# EAGLE schematic Kickerboard (EAGLE 9.6.2)
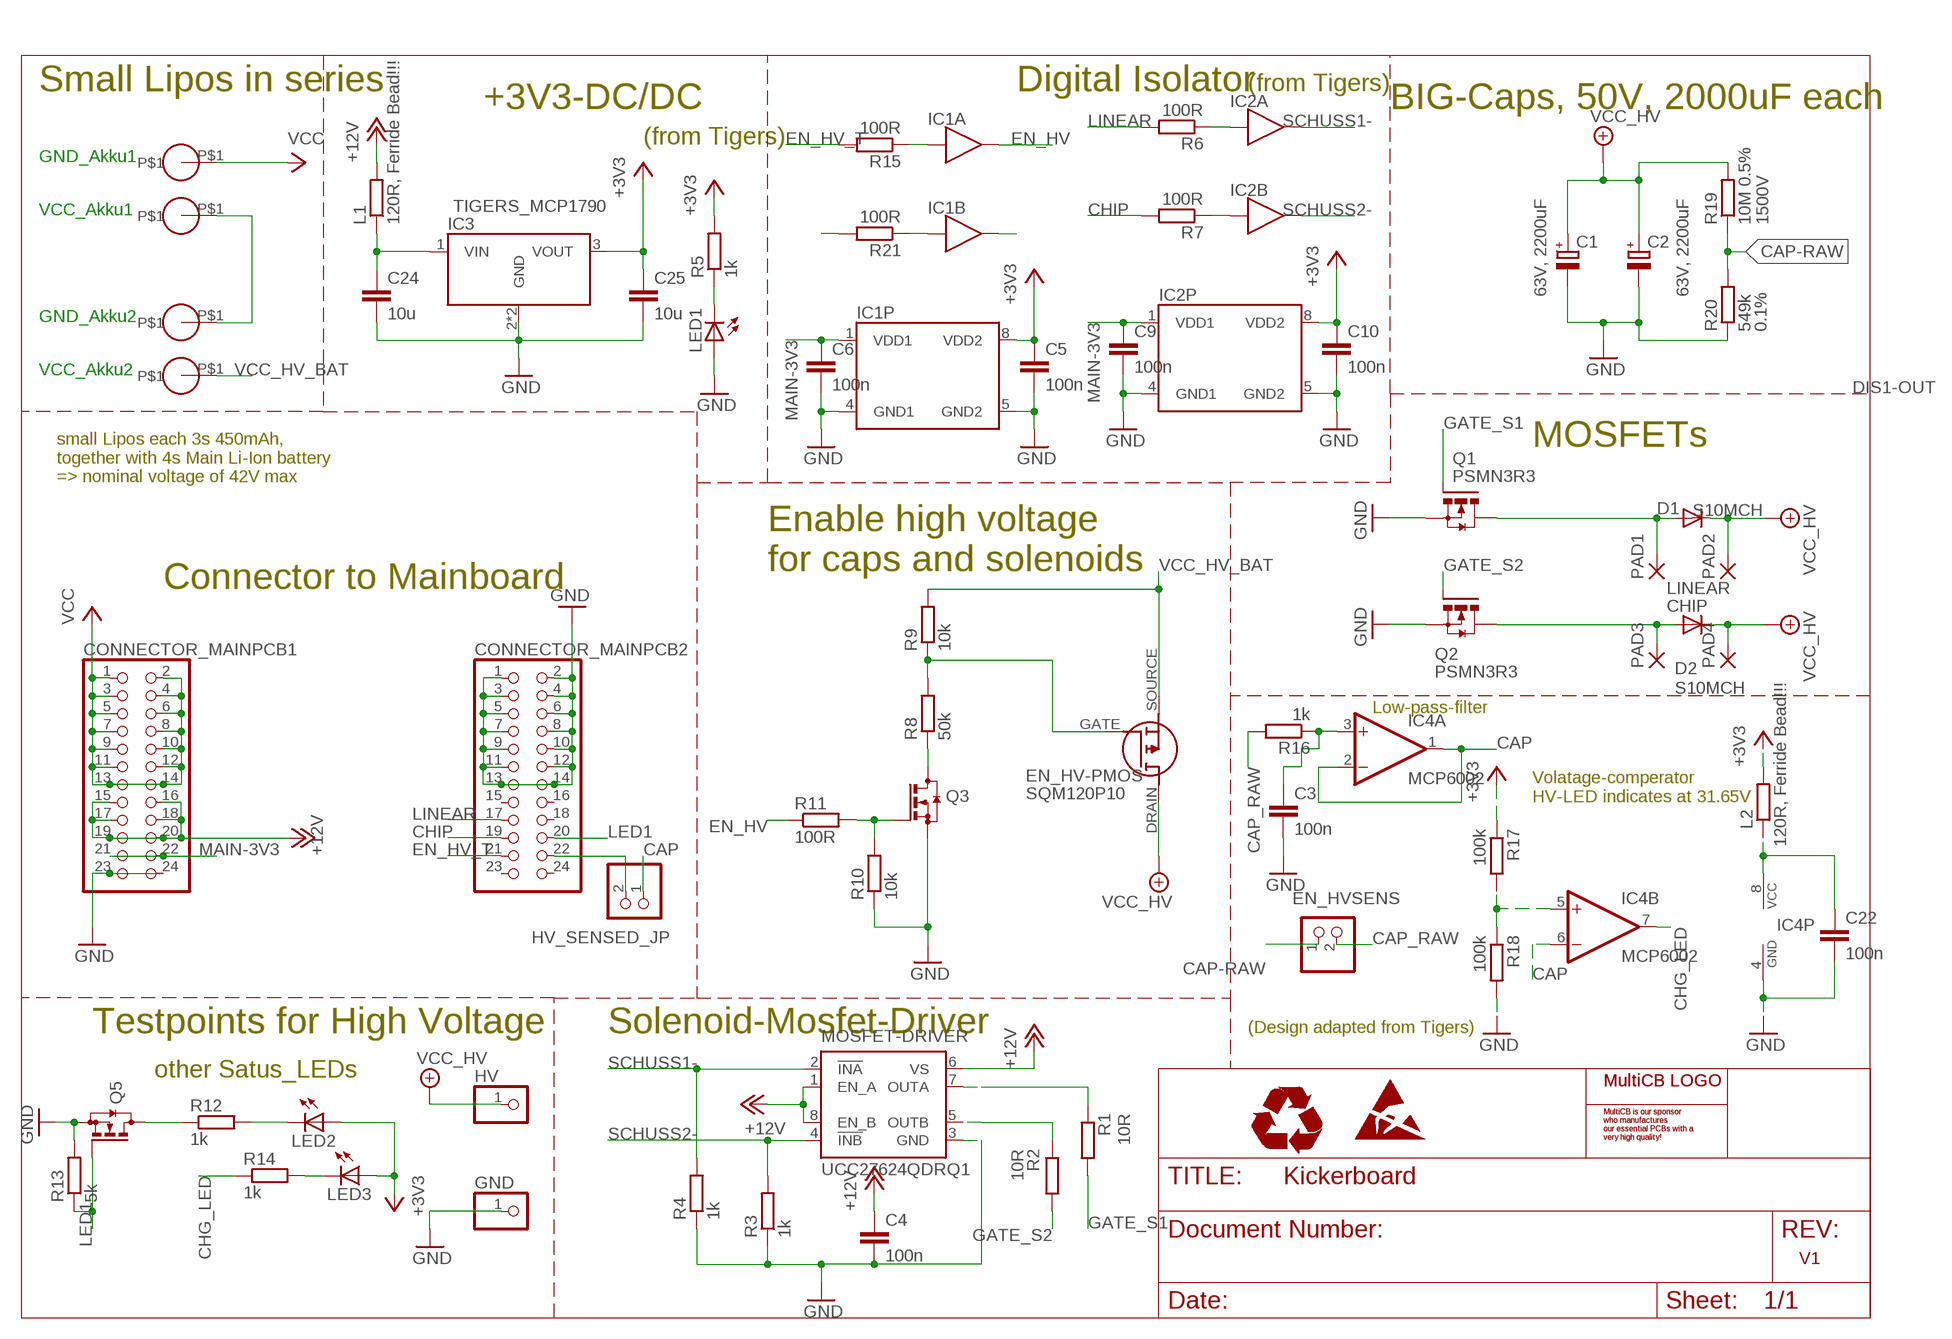
[diagram p0: schematic, sheet 1]

## Parts
C1  63V, 2200uF  OPEN24_SCHUSS_KONDENSATOR(18MM)E7.5-18  [OPEN24_RCL_E7,5-18]
C2  63V, 2200uF  OPEN24_SCHUSS_KONDENSATOR(18MM)E7.5-18  [OPEN24_RCL_E7,5-18]
C3  100n  C-EUC0603  [C0603]
C4  100n  C-EUC0603  [C0603]
C5  100n  C-EUC0603  [C0603]
C6  100n  C-EUC0603  [C0603]
C9  100n  C-EUC0603  [C0603]
C10  100n  C-EUC0603  [C0603]
C22  100n  C-EUC0603  [C0603]
C24  10u  C-EUC0603  [C0603]
C25  10u  C-EUC0603  [C0603]
CONNECTOR_MAINPCB1  PINHD-2X12  [2X12]
CONNECTOR_MAINPCB2  PINHD-2X12  [2X12]
D1  S10MCH  OPEN24_SCHUSS_DIODESMC  [OPEN24_DIODE_SMC:1]
D2  S10MCH  OPEN24_SCHUSS_DIODESMC  [OPEN24_DIODE_SMC:1]
EN_HV-PMOS  SQM120P10  SQM120P10_10M1LGE3_SQM120P10_10M1LGE3  [SQM120P10_10M1LGE3_SQM120P10_10M1LGE3]
EN_HVSENS  PINHD-1X2  [1X02]
GND  PINHD-1X1  [1X01]
GND_A1  MOTOR-DRIVER_PPAD  [MOTOR-DRIVER_PPAD]
GND_A2  MOTOR-DRIVER_PPAD  [MOTOR-DRIVER_PPAD]
HV  PINHD-1X1  [1X01]
HV_SENSED_JP  PINHD-1X2  [1X02]
IC1  TIGERS_SI8620  [TIGERS_SOIC8N]
IC2  TIGERS_SI8620  [TIGERS_SOIC8N]
IC3  TIGERS_MCP1790  [TIGERS_SOT223]
IC4  MCP6002  TIGERS_AD-OP2SN  [TIGERS_SOIC8N]
L1  120R, Ferride Bead!!!  R-EU_R0603  [R0603]
L2  120R, Ferride Bead!!!  R-EU_R0603  [R0603]
LED1  POWER_LED-GREEN-CHIPLED_0805  [POWER_DISTRIBUTION_CHIPLED_0805]
LED2  POWER_LED-GREEN-CHIPLED_0805  [POWER_DISTRIBUTION_CHIPLED_0805]
LED3  POWER_LED-GREEN-CHIPLED_0805  [POWER_DISTRIBUTION_CHIPLED_0805]
MOSFET-DRIVER  UCC27624QDRQ1  IR_IR4426S  [IR_SO08]
PAD1  LINEAR  TIGERS_WIREPAD2,54/1,0  [TIGERS_2,54/1,0]
PAD2  LINEAR  TIGERS_WIREPAD2,54/1,0  [TIGERS_2,54/1,0]
PAD3  CHIP  TIGERS_WIREPAD2,54/1,0  [TIGERS_2,54/1,0]
PAD4  CHIP  TIGERS_WIREPAD2,54/1,0  [TIGERS_2,54/1,0]
Q1  PSMN3R3  PSMNR55-40SSHJ_PSMN3R3-100SSFJ  [PSMNR55-40SSHJ_BUK7S1R540HJ]
Q2  PSMN3R3  PSMNR55-40SSHJ_PSMN3R3-100SSFJ  [PSMNR55-40SSHJ_BUK7S1R540HJ]
Q3  MMFTN123  TRANSISTOR_BSS123  [TRANSISTOR-SMALL-SIGNAL_SOT23]
Q5  bss138  TRANSISTOR_BSS123  [TRANSISTOR-SMALL-SIGNAL_SOT23]
R1  10R  R-EU_R1206  [R1206]
R2  10R  R-EU_R1206  [R1206]
R3  1k  R-EU_R0603  [R0603]
R4  1k  R-EU_R0603  [R0603]
R5  1k  R-EU_R0603  [R0603]
R6  100R  R-EU_R0603  [R0603]
R7  100R  R-EU_R0603  [R0603]
R8  50k  R-EU_R0603  [R0603]
R9  10k  R-EU_R0603  [R0603]
R10  10k  R-EU_R0603  [R0603]
R11  100R  R-EU_R0603  [R0603]
R12  1k  R-EU_R0603  [R0603]
R13  5k  R-EU_R0603  [R0603]
R14  1k  R-EU_R0603  [R0603]
R15  100R  R-EU_R0603  [R0603]
R16  1k  R-EU_R0603  [R0603]
R17  100k  R-EU_R0603  [R0603]
R18  100k  R-EU_R0603  [R0603]
R19  10M 0.5%  R-EU_R1206  [R1206]
R20  549k  R-EU_R0603  [R0603]
R21  100R  R-EU_R0603  [R0603]
U$1  MULTICB_LOGOSTANDART  [SMALL_STANDARTLOGO_28MM]
U$2  MULTICB_LOGOMINI  [MINI_LOGO_17MM]
VCC_A1  MOTOR-DRIVER_PPAD  [MOTOR-DRIVER_PPAD]
VCC_A2  MOTOR-DRIVER_PPAD  [MOTOR-DRIVER_PPAD]

## Nets
+3V3: C5.1 C10.1 C25.1 IC1.8(P:VDD2) IC2.8(P:VDD2) IC3.3(VOUT) L2.2 LED2.A LED3.A R5.2 R17.1
+12V: C4.1 CONNECTOR_MAINPCB1.15 CONNECTOR_MAINPCB1.16 CONNECTOR_MAINPCB1.17 CONNECTOR_MAINPCB1.18 CONNECTOR_MAINPCB1.19 CONNECTOR_MAINPCB1.20 L1.2 MOSFET-DRIVER.1(EN_A) MOSFET-DRIVER.6(VS) MOSFET-DRIVER.8(EN_B)
CAP: HV_SENSED_JP.1 IC4.1(A:OUT) IC4.2(A:-IN) IC4.6(B:-IN)
CAP-RAW: EN_HVSENS.1 R19.1 R20.2
CAP_RAW: EN_HVSENS.2 R16.2
CHG_LED: IC4.7(B:OUT) R14.1
CHIP: CONNECTOR_MAINPCB2.19 R7.2
EN_HV: IC1.7(A:OUT) R11.1
EN_HV_T: CONNECTOR_MAINPCB2.21 R15.2
GATE_S1: Q1.1(G) R1.2
GATE_S2: Q2.1(G) R2.2
GND: C1.- C2.- C3.2 C4.2 C5.2 C10.2 C22.2 C24.2 C25.2 CONNECTOR_MAINPCB1.23 CONNECTOR_MAINPCB1.24 CONNECTOR_MAINPCB2.1 CONNECTOR_MAINPCB2.2 CONNECTOR_MAINPCB2.3 CONNECTOR_MAINPCB2.4 CONNECTOR_MAINPCB2.5 CONNECTOR_MAINPCB2.6 CONNECTOR_MAINPCB2.7 CONNECTOR_MAINPCB2.8 CONNECTOR_MAINPCB2.9 CONNECTOR_MAINPCB2.10 CONNECTOR_MAINPCB2.11 CONNECTOR_MAINPCB2.12 CONNECTOR_MAINPCB2.13 CONNECTOR_MAINPCB2.14 GND.1 IC1.5(P:GND2) IC2.5(P:GND2) IC3.2(GND) IC3.4(GND) IC4.4(P:GND) LED1.A MOSFET-DRIVER.3(GND) Q1.2(S) Q1.3(S) Q1.4(S) Q2.2(S) Q2.3(S) Q2.4(S) Q3.2(S) Q5.2(S) R3.1 R4.1 R10.1 R13.2 R18.2 R20.1
LED1: CONNECTOR_MAINPCB2.20 Q5.1(G) R13.1
LINEAR: CONNECTOR_MAINPCB2.17 R6.2
MAIN-3V3: C6.1 C9.1 CONNECTOR_MAINPCB1.21 CONNECTOR_MAINPCB1.22 IC1.1(P:VDD1) IC2.1(P:VDD1)
N$1: MOSFET-DRIVER.5(OUTB) R2.1
N$2: MOSFET-DRIVER.7(OUTA) R1.1
N$3: D2.A PAD3.1(P) Q2.5(D) Q2.6(D)
N$4: IC2.2(A:IN) R6.1
N$5: IC2.3(B:IN) R7.1
N$6: EN_HV-PMOS.GATE(G) R8.2 R9.1
N$7: Q3.3(D) R8.1
N$8: C24.1 IC3.1(VIN) L1.1
N$9: IC1.2(A:IN) R15.1
N$10: D1.A PAD1.1(P) Q1.5(D) Q1.6(D)
N$11: Q3.1(G) R10.2 R11.2
N$12: IC1.3(B:IN) R21.1
N$13: LED2.C R12.2
N$14: Q5.3(D) R12.1
N$15: LED1.C R5.1
N$16: CONNECTOR_MAINPCB2.22 HV_SENSED_JP.2
N$17: LED3.C R14.2
N$18: C6.2 C9.2 IC1.4(P:GND1) IC2.4(P:GND1) ; supply symbol labelled GND
N$19: R21.2
N$20: C3.1 IC4.3(A:+IN) R16.1
N$21: IC4.5(B:+IN) R17.2 R18.1
N$22: IC1.6(B:OUT)
N$25: GND_A2.P$1 VCC_A1.P$1
N$196: C22.1 IC4.8(P:VCC) L2.1
SCHUSS1-: IC2.7(A:OUT) MOSFET-DRIVER.2(!INA) R4.2
SCHUSS2-: IC2.6(B:OUT) MOSFET-DRIVER.4(!INB) R3.2
VCC: CONNECTOR_MAINPCB1.1 CONNECTOR_MAINPCB1.2 CONNECTOR_MAINPCB1.3 CONNECTOR_MAINPCB1.4 CONNECTOR_MAINPCB1.5 CONNECTOR_MAINPCB1.6 CONNECTOR_MAINPCB1.7 CONNECTOR_MAINPCB1.8 CONNECTOR_MAINPCB1.9 CONNECTOR_MAINPCB1.10 CONNECTOR_MAINPCB1.11 CONNECTOR_MAINPCB1.12 CONNECTOR_MAINPCB1.13 CONNECTOR_MAINPCB1.14 GND_A1.P$1
VCC_HV: C1.+ C2.+ D1.C D2.C EN_HV-PMOS.DRAIN(D) HV.1 PAD2.1(P) PAD4.1(P) R19.2
VCC_HV_BAT: EN_HV-PMOS.SOURCE(S) R9.2 VCC_A2.P$1
Unconnected: CONNECTOR_MAINPCB2.15 CONNECTOR_MAINPCB2.16 CONNECTOR_MAINPCB2.18 CONNECTOR_MAINPCB2.23 CONNECTOR_MAINPCB2.24

## Notes on the sheet
- Small Lipos in series | Digital Isolator | (from Tigers)
- +3V3-DC/DC | BIG-Caps, 50V, 2000uF each
- (from Tigers)
- GND_Akku1
- VCC_Akku1
- GND_Akku2
- VCC_Akku2
- MOSFETs
- small Lipos each 3s 450mAh,
  together with 4s Main Li-Ion battery 
  => nominal voltage of 42V max
- Enable high voltage 
  for caps and solenoids
- Connector to Mainboard
- Low-pass-filter
- Volatage-comperator
  HV-LED indicates at 31.65V
- Testpoints for High Voltage | Solenoid-Mosfet-Driver | (Design adapted from Tigers)
- other Satus_LEDs
- V1

## Library data of the parts
C1 C2 = Schussboard:OPEN24_SCHUSS_KONDENSATOR(18MM): POLARIZED CAPACITOR, European symbol; SPICEPREFIX: C
C3-C6 C9 C10 C22 C24 C25 = rcl:C-EU: CAPACITOR, European symbol; SPICEPREFIX: C
CONNECTOR_MAINPCB1 CONNECTOR_MAINPCB2 = pinhead:PINHD-2X12: PIN HEADER
D1 D2 = Schussboard:OPEN24_SCHUSS_DIODE: DIODE
EN_HV-PMOS = Schussboard:SQM120P10_10M1LGE3_SQM120P10_10M1LGE3: Trans MOSFET P-CH 100V 120A Automotive 3-Pin(2+Tab) D2PAK Source: Datasheet <https://www.vishay.com/docs/76943/sqm120p10-10m1l.pdf>; DESCRIPTION: Trans MOSFET P-CH 100V 120A Automotive 3-Pin(2+Tab) D2PAK; HEIGHT: 0.19mm; MANUFACTURER_NAME: Vishay; MANUFACTURER_PART_NUMBER: SQM120P10_10M1LGE3; MOUSER_PART_NUMBER: 78-SQM120P1010M1LGE3; MOUSER_PRICE-STOCK: https://www.mouser.co.uk/ProductDetail/Vishay-Semiconductors/SQM120P10_10M1LGE3?qs=G1ssh2j%252Bqz5tiHgZruj39A%3D%3D
EN_HVSENS HV_SENSED_JP = pinhead:PINHD-1X2: PIN HEADER
GND HV = pinhead:PINHD-1X1: PIN HEADER
GND_A1 GND_A2 VCC_A1 VCC_A2 = small_bat_pad:MOTOR-DRIVER_PPAD
IC1 IC2 = Schussboard:TIGERS_SI8620
IC3 = Schussboard:TIGERS_MCP1790
IC4 = Kicking Device v13b:TIGERS_AD-OP2
L1 L2 R1-R18 R21 = rcl:R-EU_: RESISTOR, European symbol; SPICEPREFIX: R
LED1-LED3 = Open24:POWER_LED: LED; MF: Würth Elektronik; MPN: 150080GS75000
MOSFET-DRIVER = Schussboard:IR_IR4426: DUAL LOW SIDE DRIVER Source: ID4426.pdf; MF: INTERNATIONAL RECTIFIER(IR); MPN: IR4426S; OC_FARNELL: 1023266; OC_NEWARK: 27C6913
PAD1-PAD4 = Kicking Device v13b:TIGERS_WIREPAD: Wire PAD connect wire on PCB
Q1 Q2 = Schussboard:PSMNR55-40SSHJ_PSMN3R3-100SSFJ: MOSFET PSMNR55-40SSH/SOT1235/LFPAK88 Source: Datasheet; DESCRIPTION: MOSFET PSMNR55-40SSH/SOT1235/LFPAK88; HEIGHT: 1.85mm; MANUFACTURER_NAME: Nexperia; MANUFACTURER_PART_NUMBER: PSMNR55-40SSHJ; MOUSER_PART_NUMBER: 771-PSMNR55-40SSHJ; MOUSER_PRICE-STOCK: https://www.mouser.co.uk/ProductDetail/Nexperia/PSMNR55-40SSHJ?qs=ljCeji4nMDllQgSPPJscmQ%3D%3D
Q3 Q5 = Open24:TRANSISTOR_BSS123: N-CHANNEL MOS FET
R19 = rcl:R-EU_: RESISTOR, European symbol; SPICEPREFIX: R; VMAX: 1500V
R20 = rcl:R-EU_: RESISTOR, European symbol; SPICEPREFIX: R; TOL: 0.1%
U$1 U$2 = MultiCB_logos:MULTICB_LOGO

## Net classes
1 HV: width 0.203 mm, drill 0.305 mm, clearance 0.762 mm